# EasyEDA Pro project ESP32 Dev Board.eprj

# Schematic Schematic1
Create Date: 2024-06-08; Page Name: P1; Project Name: ESP32 Dev Board; Schematic Name: Schematic1; Update Date: 2024-06-10; Company: EasyEDA.com; Drawn: EasyEDA; Page Size: A4; Part Number: JLCPCB-002; Reviewed: EasyEDA; Version: V0.1
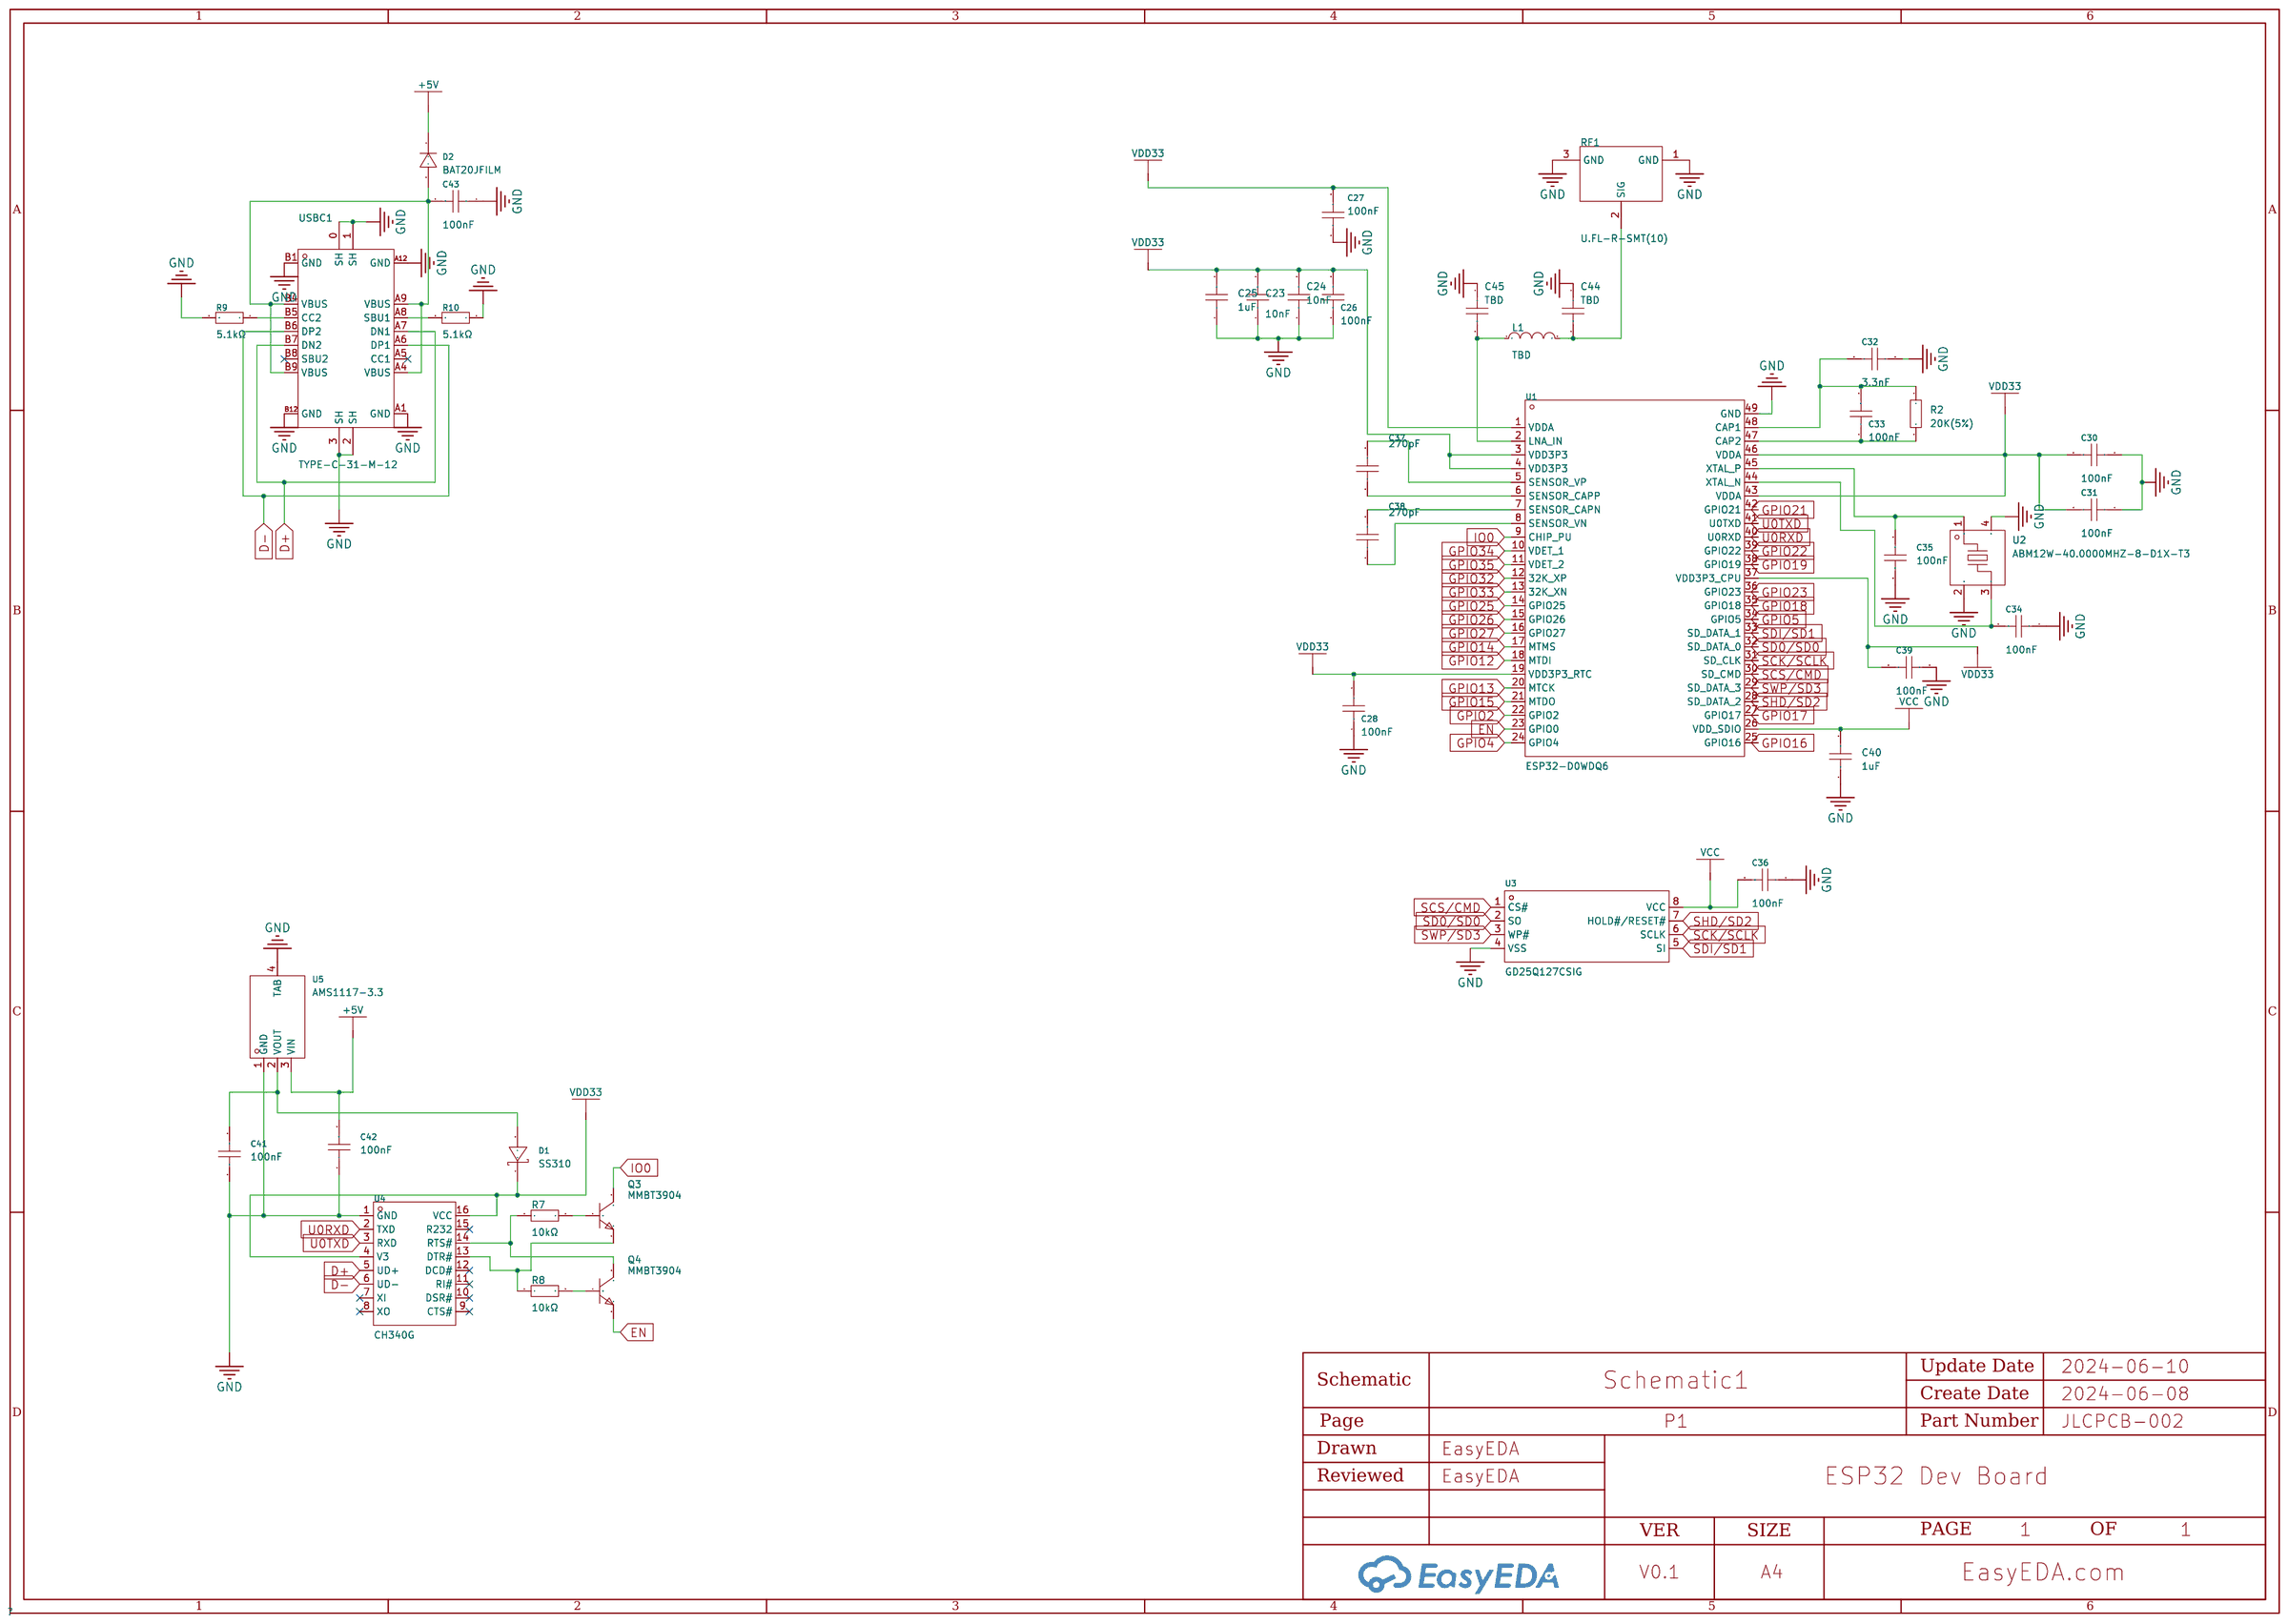
[diagram p0: schematic sheet]

## Parts
C23  10nF  [C0402]
C24  10nF  [C0402]
C25  1uF  [C0402]
C26  100nF  [C0402]
C27  100nF  [C0402]
C28  100nF  [C0402]
C30  100nF  [C0402]
C31  100nF  [C0402]
C32  3.3nF  [C0402]
C33  100nF  [C0402]
C34  100nF  [C0402]
C35  100nF  [C0402]
C36  100nF  [C0402]
C37  270pF  [C0402]
C38  270pF  [C0402]
C39  100nF  [C0402]
C40  1uF  [C0402]
C41  100nF  [C0402]
C42  100nF  [C0402]
C43  100nF  [C0402]
C44  TBD  [C0603]
C45  TBD  [C0603]
D1  SS310  [SMA_L4.4-W2.8-LS5.4-RD]
D2  BAT20JFILM  [SOD-323_L1.8-W1.3-LS2.5-RD]
L1  TBD  [L0603]
Q3  MMBT3904  [SOT-23-3_L2.9-W1.3-P1.90-LS2.4-BR]
Q4  MMBT3904  [SOT-23-3_L2.9-W1.3-P1.90-LS2.4-BR]
R2  20K(5%)  [R0603]
R7  10kΩ  [R0402]
R8  10kΩ  [R0402]
R9  5.1kΩ  [R0402]
R10  5.1kΩ  [R0402]
RF1  U.FL-R-SMT(10)  [ANT-SMD_UFL-R-SMT01]
U1  ESP32-D0WDQ6  [QFN-48_L6.0-W6.0-P0.40-BL-EP3.8]
U2  ABM12W-40.0000MHZ-8-D1X-T3  [CRYSTAL-SMD_4P-L1.6-W1.2-BL]
U3  GD25Q127CSIG  [SOP-8_L5.3-W5.3-P1.27-LS8.0-BL]
U4  CH340G  [SOIC-16_L9.9-W3.9-P1.27-LS6.0-BL]
U5  AMS1117-3.3  [SOT-223-3_L6.5-W3.4-P2.30-LS7.0-BR]
USBC1  TYPE-C-31-M-12  [USB-C_SMD-TYPE-C-31-M-12]

## Library data of the parts
C23 C24 = 0402B103K160NT: Capacitance:10nF Tolerance:±10% Tolerance:±10% Voltage Rated: Temperature Coefficient:; LCSC Part Name: 10nF ±10% 16V; Supplier Part: C284979; Manufacturer: FH(风华); Supplier Footprint: 0402; JLCPCB Part Class: Extended Part; Datasheet: https://atta.szlcsc.com/upload/public/pdf/source/20200305/C486355_26A10D38EF8C2A5C37091D0039909270.pdf; Supplier: LCSC; Tolerance: ±10%
C25 C40 = C0402X5R105K350NT: Capacitance: Tolerance:±10% Tolerance:±10% Voltage Rated: Temperature Coefficient:; LCSC Part Name: 1uF ±10% 35V; Supplier Part: C968773; Manufacturer: SANYEAR(叁叶源); Supplier Footprint: 0402; JLCPCB Part Class: Extended Part; Supplier: LCSC; Tolerance: ±10%
C26-C28 C30 C31 C33-C36 C39 C41-C43 = CT41G-0402-2X1-16V-0.1μF-K(N): Capacitance: Tolerance:±10% Tolerance:±10% Voltage Rated: Temperature Coefficient:; LCSC Part Name: 100nF ±10% 16V; Supplier Part: C141382; Manufacturer: TORCH(火炬); Supplier Footprint: 0402; JLCPCB Part Class: Extended Part; Datasheet: https://atta.szlcsc.com/upload/public/pdf/source/20171225/C150708_15141883600121203188.pdf; Supplier: LCSC; Tolerance: ±10%
C32 = 04025C332KAT2A: Capacitance: Tolerance:±10% Tolerance:±10% Voltage Rated: Temperature Coefficient:; LCSC Part Name: 3.3nF ±10% 50V; Supplier Part: C167426; Manufacturer: Kyocera AVX; Supplier Footprint: 0402; JLCPCB Part Class: Extended Part; Datasheet: https://atta.szlcsc.com/upload/public/pdf/source/20180224/C180862_15194369279611363953.pdf; Supplier: LCSC; Tolerance: ±10%
C37 C38 = 0402N271J500CT: Capacitance: Tolerance:±5% Tolerance:±5% Voltage Rated: Temperature Coefficient:; LCSC Part Name: 270pF ±5% 50V; Supplier Part: C301975; Manufacturer: Walsin(华新科); Supplier Footprint: 0402; JLCPCB Part Class: Extended Part; Datasheet: https://atta.szlcsc.com/upload/public/pdf/source/20191217/C469650_84AD5C6F618CF4AC0C6D987F2E8FE6F8.pdf; Supplier: LCSC; Tolerance: ±5%
C44 C45 = CAP_0603: Supplier Footprint: 0603
D1 = SS310_C116705: Forward Voltage (Vf@If):850mV@3A Reverse Voltage (Vr):100V Average Rectified Current (Io):3A Reverse Leakage Current (Ir):300uA@100V Peak forward surge current:80A; LCSC Part Name: 电压:100V 电流:3A; Supplier Part: C116705; Manufacturer: 晶导微电子; Supplier Footprint: SMA(DO-214AC); JLCPCB Part Class: Extended Part; Datasheet: https://atta.szlcsc.com/upload/public/pdf/source/20170804/C123938_1501836222047866178.pdf; Supplier: LCSC; Forward Voltage (Vf@If): 850mV@3A; Reverse Voltage (Vr): 100V; Average Rectified Current (Io): 3A; Reverse Leakage Current (Ir): 300uA@100V; Peak forward surge current: 80A
D2 = BAT20JFILM: Forward Voltage (Vf@If):620mV@1A Reverse Voltage (Vr):23V Average Rectified Current (Io):1A Reverse Leakage Current (Ir):12uA@15V; LCSC Part Name: 电压:23V 电流:1A; Supplier Part: C155590; Manufacturer: ST(意法半导体); Supplier Footprint: SOD-323; JLCPCB Part Class: Extended Part; Datasheet: https://atta.szlcsc.com/upload/public/pdf/source/20180105/C155590_15151361543791233625.pdf; Supplier: LCSC; Forward Voltage (Vf@If): 620mV@1A; Reverse Voltage (Vr): 23V; Average Rectified Current (Io): 1A; Reverse Leakage Current (Ir): 12uA@15V
L1 = L_0603
Q3 Q4 = MMBT3904_C163254: Transistor Type: Collector Current (Ic): Collector-Emitter Breakdown Voltage (Vceo): Power Dissipation (Pd): DC Current Gain (hFE@Ic,Vce):100@10mA,1V DC Current Gain (hFE@Ic,Vce):100@10mA,1V Transition Frequency (fT):300MHz Collector Cut-Off Current (Icbo; LCSC Part Name: NPN 电流:200mA 耐压:40V; Supplier Part: C163254; Manufacturer: FMS(美丽微); Supplier Footprint: SOT-23; JLCPCB Part Class: Extended Part; Datasheet: https://atta.szlcsc.com/upload/public/pdf/source/20180131/C163254_15173931062661329070.pdf; Supplier: LCSC; DC Current Gain (hFE@Ic,Vce): 100@10mA,1V; Transition Frequency (fT): 300MHz; Collector Cut-Off Current (Icbo): 50nA; Collector-Emitter Saturation Voltage (VCE(sat)@Ic,Ib): 300mV@50mA,5mA
R2 = Res_0603: Supplier Footprint: 0603
R7 R8 = RMC040210KFN: Resistance: Tolerance:±1% Tolerance:±1% Power(Watts):; LCSC Part Name: 10kΩ ±1% 62.5mW; Supplier Part: C269674; Manufacturer: Tyohm(幸亚电阻); Supplier Footprint: 0402; JLCPCB Part Class: Extended Part; Datasheet: https://atta.szlcsc.com/upload/public/pdf/source/20190115/C325956_D27151D492FFB3C9AB4A6F14FE01F30A.pdf; Supplier: LCSC; Tolerance: ±1%
R9 R10 = RMC04025.1K1%N: Resistance: Tolerance:±1% Tolerance:±1% Power(Watts):; LCSC Part Name: 5.1kΩ ±1% 62.5mW; Supplier Part: C325521; Manufacturer: Tyohm(幸亚电阻); Supplier Footprint: 0402; JLCPCB Part Class: Extended Part; Datasheet: https://atta.szlcsc.com/upload/public/pdf/source/20190115/C325956_D27151D492FFB3C9AB4A6F14FE01F30A.pdf; Supplier: LCSC; Tolerance: ±1%
RF1 = U.FL-R-SMT(10): Connector Type:板端 Interface Type:内针 Number of Ports:1 Interface Diameter:2mm Interface Length/Height:1.25mm Frequency-Max:6GHz RF Series:IPEX Impedance:50Ω Style:- Contact Material:Brass Operating Temperature Range:-40℃~+90℃ Operating Temperature Range:-4; LCSC Part Name: IPEX 内针; Supplier Part: C434808; Manufacturer: HRS(广濑); Supplier Footprint: SMD; JLCPCB Part Class: Extended Part; Datasheet: https://atta.szlcsc.com/upload/public/pdf/source/20191010/C434816_11DAC26C7ED37A2D3E584E7DBDF6972E.pdf; Supplier: LCSC; Connector Type: 板端; Interface Type: 内针; Number of Ports: 1; Interface Diameter: 2mm; Interface Length/Height: 1.25mm; Frequency-Max: 6GHz; RF Series: IPEX; Impedance: 50Ω; Contact Material: Brass; Operating Temperature Range: -40℃~+90℃
U1 = ESP32-D0WDQ6: Frequency Range:2.4GHz Frequency Range:2.4GHz Interface:I2C,I2S,SPI,UART Operating Voltage:2.3V~3.6V Operating Voltage:2.3V~3.6V Applications:蓝牙,WiFi Output Power:20dBm Data Rate:150Mbps Current Of Transmitting:240mA Sensitivity:-98dBm Receive Current:100; Supplier Part: C129733; Manufacturer: ESPRESSIF(乐鑫); Supplier Footprint: QFN-48-EP(6x6); JLCPCB Part Class: Extended Part; Datasheet: https://atta.szlcsc.com/upload/public/pdf/source/20180207/C129733_15179947908541359020.pdf; Supplier: LCSC; Frequency Range: 2.4GHz; Interface: I2C,I2S,SPI,UART; Operating Voltage: 2.3V~3.6V; Applications: 蓝牙,WiFi; Output Power: 20dBm; Data Rate: 150Mbps; Current Of Transmitting: 240mA; Sensitivity: -98dBm; Receive Current: 100mA; Operating Temperature: -40℃~+125℃
U2 = ABM12W-40.0000MHZ-8-D1X-T3: Supplier Part: C9900011192; Supplier Footprint: CRYSTAL-SMD; JLCPCB Part Class: Extended Part; Supplier: LCSC
U3 = GD25Q127CSIG: Supplier Part: C79079; Manufacturer: GigaDevice(兆易创新); Supplier Footprint: SOP-8-208mil; JLCPCB Part Class: Extended Part; Datasheet: https://atta.szlcsc.com/upload/public/pdf/source/20171014/C79079_15079757657721038544.pdf; Supplier: LCSC
U4 = CH340G: Applications Function:Transceiver Protocol: Supply Voltage:3.3V；5V Supply Voltage:3.3V；5V Data Rate:2Mbps; LCSC Part Name: USB转串口芯片 CH340; Supplier Part: C14267; Manufacturer: WCH(南京沁恒); Supplier Footprint: SOP-16; JLCPCB Part Class: Extended Part; Datasheet: https://atta.szlcsc.com/upload/public/pdf/source/20230530/6E401E9554E9F5311886CC8B3F89B62E.pdf; Supplier: LCSC; Applications Function: Transceiver; Supply Voltage: 3.3V；5V; Data Rate: 2Mbps
U5 = AMS1117-3.3_C351784: Output Type: Maximum Input Voltage:18V Output Voltage:3.3V Output Voltage:3.3V MAX Output Current:800mA Power Supply Rejection Ratio (PSRR):- Dropout Voltage:1.4V@(1A) Output Polarity:Positive electrode Number of Outputs:1; LCSC Part Name: 输入18V 输出3.3V 800mA; Supplier Part: C351784; Manufacturer: PUOLOP(迪浦); Supplier Footprint: SOT-223-3; JLCPCB Part Class: Extended Part; Datasheet: https://atta.szlcsc.com/upload/public/pdf/source/20210915/EA806799CEEC3F52E0A4FA8303A508AC.pdf; Supplier: LCSC; Maximum Input Voltage: 18V; Output Voltage: 3.3V; MAX Output Current: 800mA; Dropout Voltage: 1.4V@(1A); Output Polarity: Positive electrode; Number of Outputs: 1
USBC1 = TYPE-C-31-M-12: Connector Type:Type-C Standard:- Gender:Female Number of Ports:1 Number of Contacts:16P Mounting Style:- Current Rating - Power (Max):5A Contact Material:- Contact Plating:- Operating Temperature Range:- Operating Temperature Range:- Soldering Temperature; LCSC Part Name: Type-C 母; Supplier Part: C165948; Manufacturer: 韩国韩荣; Supplier Footprint: SMD; JLCPCB Part Class: Extended Part; Datasheet: https://atta.szlcsc.com/upload/public/pdf/source/20220525/466408E853115E789EDB0DDC29077C05.pdf; Supplier: LCSC; Connector Type: Type-C; Gender: Female; Number of Ports: 1; Number of Contacts: 16P; Current Rating - Power (Max): 5A

## Nets
+5V: C42.2 D2.1(K) U5.3(VIN)
GND: C23.1 C24.1 C25.1 C26.1 C27.1 C28.1 C30.1 C31.1 C32.1 C34.1 C35.2 C36.1 C39.1 C40.1 C41.1 C42.1 C43.1 C44.1 C45.1 R9.2 R10.1 RF1.1(GND) RF1.3(GND) U1.49(GND) U2.2(GND) U2.4(GND) U3.4(VSS) U4.1(GND) U5.1(GND) U5.4(TAB) USBC1.0(SH) USBC1.1(SH) USBC1.2(SH) USBC1.3(SH) USBC1.A1(GND) USBC1.A12(GND) USBC1.B1(GND) USBC1.B12(GND)
VCC: C36.2 C40.2 U1.26(VDD_SDIO) U3.8(VCC)
VDD33: C23.2 C24.2 C25.2 C26.2 C27.2 C28.2 C30.2 C31.2 C39.2 D1.1(K) U1.1(VDDA) U1.3(VDD3P3) U1.4(VDD3P3) U1.19(VDD3P3_RTC) U1.37(VDD3P3_CPU) U1.43(VDDA) U1.46(VDDA) U4.4(V3) U4.16(VCC)
D+: U4.5(UD+) USBC1.A7(DN1) USBC1.B7(DN2)
D-: U4.6(UD-) USBC1.A6(DP1) USBC1.B6(DP2)
EN: Q4.2(E) U1.23(GPIO0)
GPIO2: U1.22(GPIO2)
GPIO4: U1.24(GPIO4)
GPIO5: U1.34(GPIO5)
GPIO12: U1.18(MTDI)
GPIO13: U1.20(MTCK)
GPIO14: U1.17(MTMS)
GPIO15: U1.21(MTDO)
GPIO16: U1.25(GPIO16)
GPIO17: U1.27(GPIO17)
GPIO18: U1.35(GPIO18)
GPIO19: U1.38(GPIO19)
GPIO21: U1.42(GPIO21)
GPIO22: U1.39(GPIO22)
GPIO23: U1.36(GPIO23)
GPIO25: U1.14(GPIO25)
GPIO26: U1.15(GPIO26)
GPIO27: U1.16(GPIO27)
GPIO32: U1.12(32K_XP)
GPIO33: U1.13(32K_XN)
GPIO34: U1.10(VDET_1)
GPIO35: U1.11(VDET_2)
IO0: Q3.3(C) U1.9(CHIP_PU)
SCK/SCLK: U1.31(SD_CLK) U3.6(SCLK)
SCS/CMD: U1.30(SD_CMD) U3.1(CS#)
SD0/SD0: U1.32(SD_DATA_0) U3.2(SO)
SDI/SD1: U1.33(SD_DATA_1) U3.5(SI)
SHD/SD2: U1.28(SD_DATA_2) U3.7(HOLD#/RESET#)
SWP/SD3: U1.29(SD_DATA_3) U3.3(WP#)
U0RXD: U1.40(U0RXD) U4.2(TXD)
U0TXD: U1.41(U0TXD) U4.3(RXD)
$1N1054: C38.2 U1.7(SENSOR_CAPN)
$1N1058: C38.1 U1.8(SENSOR_VN)
$1N1106: C37.1 U1.6(SENSOR_CAPP)
$1N1396: C37.2 U1.5(SENSOR_VP)
$1N2334: C32.2 C33.2 R2.1 U1.48(CAP1)
$1N2342: C33.1 R2.2 U1.47(CAP2)
$1N2769: C35.1 U1.45(XTAL_P) U2.1(IN)
$1N2913: C34.2 U1.44(XTAL_N) U2.3(OUT)
$1N7115: Q3.1(B) R7.2
$1N7161: Q4.3(C) R7.1 U4.14(RTS#)
$1N7213: Q4.1(B) R8.2
$1N7216: Q3.2(E) R8.1 U4.13(DTR#)
$1N7414: R10.2 USBC1.A8(SBU1)
$1N7647: R9.1 USBC1.B5(CC2)
$1N7875: C43.2 D2.2(A) USBC1.A4(VBUS) USBC1.A9(VBUS) USBC1.B4(VBUS) USBC1.B9(VBUS)
$1N11049: C41.2 D1.2(A) U5.2(VOUT)
$1N11248: C45.2 L1.1 U1.2(LNA_IN)
$1N11253: C44.2 L1.2 RF1.2(SIG)

Not connected (* = marked no-connect by the designer): U4 7(XI)* 8(XO)* 9(CTS#)* 10(DSR#)* 11(RI#)* 12(DCD#)* 15(R232)*; USBC1 A5(CC1)* B8(SBU2)*

# Board PCB1
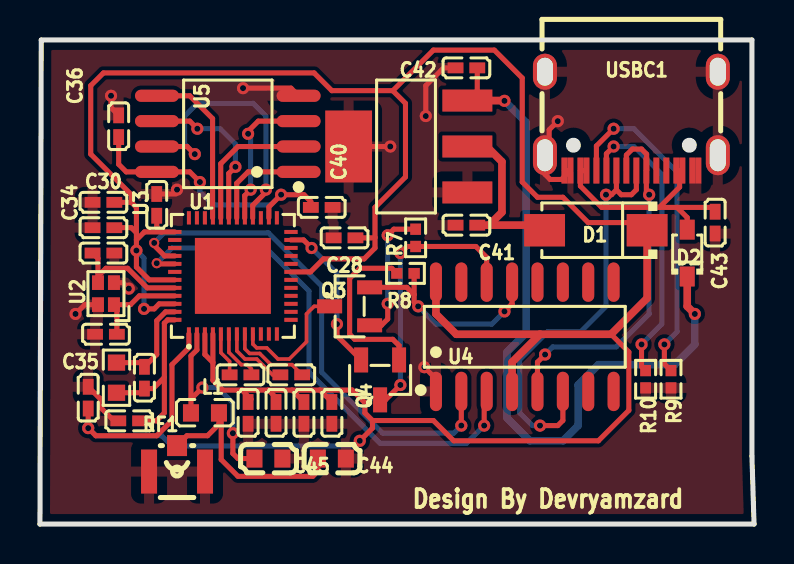
[diagram p1: board, top side]
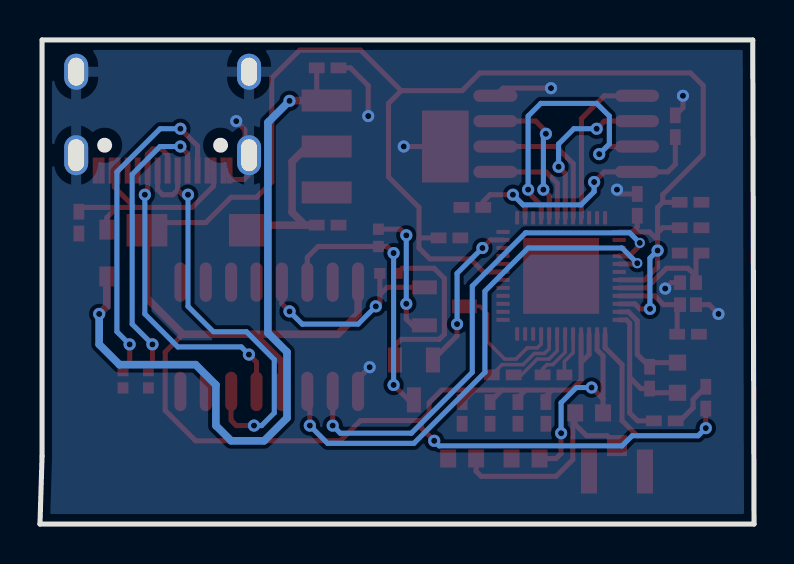
[diagram p2: board, bottom side, seen from below]

Outline 35.73 x 24.23 mm; copper layers: Top Layer, Bottom Layer. Coordinates in mm from the lower left corner of the outline.
Outline path: 0,0 35.73,0 35.62,3.41 35.62,24.23 0.06,24.23 0,0
Stack: Top Layer 0.035mm / Dielectric1 1.51mm FR4 er 4.5 / Bottom Layer 0.035mm

## Design rules (mm)
template: JLCPCB Capability(Two Layers Board)
spacing copperThickness1oz (default): track to track 0.102, other pairs 0.152 to 0.3
spacing copperThickness2oz: track to track 0.203, other pairs 0.152 to 0.3
track width copperThickness1oz (default): min 0.127, default 0.254, max 2.54
track width copperThickness2oz: min 0.203, default 0.254, max 2.54
differential pair differentialPair (default): width min 0.127, default 0.254, max 2.54; gap min 0.152, default 0.152
via viaSize (default): diameter min 0.5, default 0.61, max 10; hole min 0.3, default 0.305, max 6.3

## Placement (name value [footprint] x y rotation side)
C23  10nF  [C0402]  10.41 5.56 90 top
C24  10nF  [C0402]  11.81 5.56 90 top
C25  1uF  [C0402]  14.6 5.56 90 top
C26  100nF  [C0402]  13.21 5.56 90 top
C27  100nF  [C0402]  2.41 6.33 270 top
C28  100nF  [C0402]  15.24 14.33 0 top
C30  100nF  [C0402]  3.18 16.11 0 top
C31  100nF  [C0402]  3.18 14.84 0 top
C32  3.3nF  [C0402]  4.46 5.17 0 top
C33  100nF  [C0402]  5.23 7.33 270 top
C34  100nF  [C0402]  3.18 13.57 180 top
C35  100nF  [C0402]  3.3 9.5 180 top
C36  100nF  [C0402]  3.94 19.92 270 top
C37  270pF  [C0402]  10.03 7.47 180 top
C38  270pF  [C0402]  12.57 7.47 180 top
C39  100nF  [C0402]  5.84 15.98 270 top
C40  1uF  [C0402]  14.1 15.85 180 top
C41  100nF  [C0402]  21.34 14.96 0 top
C42  100nF  [C0402]  21.34 22.84 0 top
C43  100nF  [C0402]  33.78 15.09 90 top
C44  TBD  [C0603]  14.6 3.28 180 top
C45  TBD  [C0603]  11.43 3.28 180 top
D1  SS310  [SMA_L4.4-W2.8-LS5.4-RD]  27.81 14.71 180 top
D2  BAT20JFILM  [SOD-323_L1.8-W1.3-LS2.5-RD]  32.38 13.57 90 top
L1  TBD  [L0603]  8.25 5.56 0 top
Q3  MMBT3904  [SOT-23-3_L2.9-W1.3-P1.90-LS2.4-BR]  15.49 10.9 0 top
Q4  MMBT3904  [SOT-23-3_L2.9-W1.3-P1.90-LS2.4-BR]  17.02 7.22 90 top
R2  20K(5%)  [R0603]  3.83 7.33 90 top
R7  10kΩ  [R0402]  18.8 14.33 90 top
R8  10kΩ  [R0402]  18.29 12.55 180 top
R9  5.1kΩ  [R0402]  31.57 7.25 270 top
R10  5.1kΩ  [R0402]  30.3 7.25 90 top
RF1  U.FL-R-SMT(10)  [ANT-SMD_UFL-R-SMT01]  6.86 3.28 0 top
U1  ESP32-D0WDQ6  [QFN-48_L6.0-W6.0-P0.40-BL-EP3.8]  9.65 12.42 0 top
U2  ABM12W-40.0000MHZ-8-D1X-T3  [CRYSTAL-SMD_4P-L1.6-W1.2-BL]  3.3 11.53 90 top
U3  GD25Q127CSIG  [SOP-8_L5.3-W5.3-P1.27-LS8.0-BL]  9.4 19.53 90 top
U4  CH340G  [SOIC-16_L9.9-W3.9-P1.27-LS6.0-BL]  24.26 9.37 0 top
U5  AMS1117-3.3  [SOT-223-3_L6.5-W3.4-P2.30-LS7.0-BR]  18.41 18.9 0 top
USBC1  TYPE-C-31-M-12  [USB-C_SMD-TYPE-C-31-M-12]  29.59 20.17 180 top

## Footprints (pads in the part's own frame, mm; a bottom-side part is the same pattern mirrored in y, then rotated)
ANT-SMD_UFL-R-SMT01
  rect 0.8x2.2 smd: 1(-1.4,-0.65) 3(1.4,-0.65)
  rect 1x1.05 smd: 2(0,0.65)
C0402
  rect 0.79x0.54 smd: 1(-0.545,0) 2(0.545,0)
C0603
  rect 0.8x0.9 smd: 1(-0.7,0) 2(0.7,0)
CRYSTAL-SMD_4P-L1.6-W1.2-BL
  rect 0.73x0.6 smd: 1(-0.55,-0.4) 2(0.55,-0.4) 3(0.55,0.4) 4(-0.55,0.4)
L0603
  rect 0.8x0.864 smd: 1(-0.7,0) 2(0.7,0)
QFN-48_L6.0-W6.0-P0.40-BL-EP3.8
  rect 0.2x0.665 smd: 1(-2.2,-2.908) 2(-1.8,-2.908) 3(-1.4,-2.908) 4(-1,-2.908) 5(-0.6,-2.908) 6(-0.2,-2.908) 7(0.2,-2.908) 8(0.6,-2.908) 9(1,-2.908) 10(1.4,-2.908) 11(1.8,-2.908) 12(2.2,-2.908) 25(2.2,2.908) 26(1.8,2.908) 27(1.4,2.908) 28(1,2.908) 29(0.6,2.908) 30(0.2,2.908) 31(-0.2,2.908) 32(-0.6,2.908) 33(-1,2.908) 34(-1.4,2.908) 35(-1.8,2.908) 36(-2.2,2.908)
  rect 0.665x0.2 smd: 13(2.908,-2.2) 14(2.908,-1.8) 15(2.908,-1.4) 16(2.908,-1) 17(2.908,-0.6) 18(2.908,-0.2) 19(2.908,0.2) 20(2.908,0.6) 21(2.908,1) 22(2.908,1.4) 23(2.908,1.8) 24(2.908,2.2) 37(-2.908,2.2) 38(-2.908,1.8) 39(-2.908,1.4) 40(-2.908,1) 41(-2.908,0.6) 42(-2.908,0.2) 43(-2.908,-0.2) 44(-2.908,-0.6) 45(-2.908,-1) 46(-2.908,-1.4) 47(-2.908,-1.8) 48(-2.908,-2.2)
  rect 3.8x3.8 smd: 49(0,0)
R0402
  rect 0.566x0.54 smd: 1(-0.433,0) 2(0.433,0)
R0603
  rect 0.806x0.864 smd: 1(-0.753,0) 2(0.753,0)
SMA_L4.4-W2.8-LS5.4-RD
  rect 2.046x1.62 smd: 1(-2.566,0) 2(2.566,0)
SOD-323_L1.8-W1.3-LS2.5-RD
  rect 1x0.75 smd: 1(-1.173,0) 2(1.173,0)
SOIC-16_L9.9-W3.9-P1.27-LS6.0-BL
  oval 0.602x1.971 smd: 1(-4.445,-2.736) 2(-3.175,-2.736) 3(-1.905,-2.736) 4(-0.635,-2.736) 5(0.635,-2.736) 6(1.905,-2.736) 7(3.175,-2.736) 8(4.445,-2.736) 9(4.445,2.736) 10(3.175,2.736) 11(1.905,2.736) 12(0.635,2.736) 13(-0.635,2.736) 14(-1.905,2.736) 15(-3.175,2.736) 16(-4.445,2.736)
SOP-8_L5.3-W5.3-P1.27-LS8.0-BL
  oval 0.609x2.204 smd: 1(-1.905,-3.542) 2(-0.635,-3.542) 3(0.635,-3.542) 4(1.905,-3.542) 5(1.905,3.542) 6(0.635,3.542) 7(-0.635,3.542) 8(-1.905,3.542)
SOT-23-3_L2.9-W1.3-P1.90-LS2.4-BR
  rect 1.25x0.7 smd: 1(1,-0.95) 2(1,0.95) 3(-1,0)
SOT-223-3_L6.5-W3.4-P2.30-LS7.0-BR
  rect 2.5x1.1 smd: 1(2.97,-2.3) 2(2.97,0) 3(2.97,2.3)
  rect 2.34x3.6 smd: 4(-2.97,0)
USB-C_SMD-TYPE-C-31-M-12
  oval 1.2x2 hole 0.8x1.6: 0(-4.325,1.706) 1(4.325,1.706)
  oval 1.2x1.8 hole 0.8x1.4: 2(4.325,-2.474) 3(-4.325,-2.474)
  rect 0.3x1.3 smd: A1(-3.35,2.474) A4(-2.55,2.474) A5(-1.25,2.474) A6(-0.25,2.474) A7(0.25,2.474) A8(1.25,2.474) A9(2.55,2.474) A12(3.35,2.474) B1(3.05,2.474) B4(2.25,2.474) B5(1.75,2.474) B6(0.75,2.474) B7(-0.75,2.474) B8(-1.75,2.474) B9(-2.25,2.474) B12(-3.05,2.474)

## Nets
As in the schematic.

Pads without a net: U4 7 8 9 10 11 12 15; USBC1 A5 B8

## Via types
v1: diameter 0.61, hole 0.305, Top Layer to Bottom Layer, 43 vias
v2: diameter 0.508, hole 0.305, Top Layer to Bottom Layer, 2 vias

## Routing (per net, layer and track width the routed paths; a pad name or vN(x,y) marks a point on that pad's centre or on a via; arc(x,y) is an arc through that point)
+5V: length 37
  Top Layer w0.254: 21.38,21.2 21.88,21.7 C42.2
  Top Layer w0.381: 21.38,21.2 23.23,21.2 v1(23.24,21.19) ; v1(32.77,10.52) 32.38,10.9 D2.1
  Bottom Layer w0.381: v1(23.24,21.19) 24.32,20.1 24.32,9.57 23.37,8.61 23.37,5.31 24.51,4.17 26.16,4.17 26.92,4.93 26.92,6.96 27.94,7.98 31.75,7.98 32.77,8.99 v1(32.77,10.52)
GND: length 21.4
  Top Layer w0.254: C39.1 6.81,16.52 ; USBC1.A12 USBC1.B1 26.09,17.25 25.53,17.25 25.27,17.51 USBC1.1 25.48,18.67 25.48,19.74 v1(25.91,20.17) ; v1(19.23,7.85) 19.81,7.27 U4.1 ; v1(19.3,20.42) 19.3,21.95 20.19,22.84 20.79,22.84 ; U3.4 12.56,21.82 v1(10.16,21.82) ; v1(3.56,21.44) 3.56,20.84 C36.1 ; U2.4 2.24,10.98 v1(1.78,10.52) ; C32.1 3.7,5.17 3.05,5.82 3.05,6.24 C27.1 ; v1(4.44,11.79) 4.15,12.08 3.7,12.08 ; v1(17.53,18.9) U5.4
  vias: v1(6.86,16.74)
VCC: length 14.2
  Top Layer w0.254: C36.2 3.94,18.01 4.32,17.63 U3.8 7.49,17.63 v1(8,17.12) ; C40.2 13.55,16.14 13.21,16.49 v1(12.06,16.49) 11.45,15.87 U1.26
  Bottom Layer w0.254: v1(12.06,16.49) 11.56,15.98 8.66,15.98 8,16.64 v1(8,17.12)
VDD33: length 152.8
  Top Layer w0.254: 4.57,16.11 4.83,15.85 4.83,14.58 ; 4.57,16.11 4.57,16.49 2.54,18.52 2.54,21.95 3.18,22.58 13.72,22.58 14.6,21.69 17.65,21.69 ; 4.57,16.11 C30.2 ; 17.65,21.69 19.69,23.73 22.73,23.73 24.13,22.33 24.13,17.12 24.89,16.36 26.16,16.36 27.43,15.09 30,15.09 D1.1 ; 17.65,21.69 18.29,21.06 18.29,17.38 16.76,15.85 16.76,14.34 ; 14.01,6.71 15.62,6.71 16.26,6.07 16.26,5.56 16.64,5.18 ; 14.01,6.71 C25.2 ; 14.01,6.71 12.61,6.71 ; 16.64,5.18 19.69,5.18 20.7,4.17 27.94,4.17 29.46,5.69 29.46,8.61 28.57,9.5 ; 16.64,5.18 16.64,4.8 v1(16,4.17) ; 4.83,14.22 v1(4.83,13.69) 4.83,12.87 5.47,12.22 U1.43 ; 4.83,14.22 5.23,14.62 6.1,14.62 ; 4.83,14.22 4.83,14.58 ; C27.2 v1(2.41,4.8) 2.79,4.42 5.84,4.42 6.6,5.18 6.6,7.98 7.45,8.83 U1.1 ; C31.2 4.57,14.84 4.83,14.58 ; C26.2 12.61,6.71 ; 12.61,6.71 11.43,6.71 ; U1.46 5.97,11.02 5.72,10.77 v1(5.21,10.77) ; C39.2 5.84,14.88 6.1,14.62 ; 6.1,14.62 U1.37 ; 8.65,8.09 8.65,7.2 9.14,6.71 10.1,6.71 ; 8.65,8.09 U1.4 ; 8.65,8.09 8.25,8.49 U1.3 ; U1.19 13.53,12.62 14.19,13.27 16.22,13.27 16.76,13.82 16.76,14.34 ; C23.2 10.56,6.25 10.1,6.71 ; 10.1,6.71 11.43,6.71 ; C28.2 16.75,14.33 16.76,14.34 ; 11.43,6.71 11.81,6.33 C24.2
  Top Layer w0.381: 25.02,9.5 28.57,9.5 30.38,11.3 D1.1 ; 25.02,9.5 23.62,8.1 U4.4 ; 25.02,9.5 20.83,9.5 19.81,10.52 U4.16
  Bottom Layer w0.254: v1(2.41,4.8) 2.79,4.42 6.1,4.42 6.6,3.91 15.75,3.91 v1(16,4.17) ; v1(5.21,10.77) 5.21,13.31 v1(4.83,13.69)
D+: length 18.1
  Top Layer w0.254: U4.5 24.89,8.1 v1(25.27,8.48) ; USBC1.A7 29.34,18.47 29.64,18.77 30.1,18.77 30.35,18.52 30.35,17.71 USBC1.B7 30.34,16.62 v1(30.48,16.49)
  Bottom Layer w0.254: v1(30.48,16.49) 30.48,10.52 28.83,8.87 25.65,8.87 v1(25.27,8.48)
D-: length 21.4
  Top Layer w0.254: 28.84,16.73 28.6,16.49 v1(28.32,16.49) ; 28.84,16.73 USBC1.B6 ; 28.84,16.73 29.08,16.49 29.59,16.49 29.84,16.74 USBC1.A6 ; U4.6 26.16,5.18 25.91,4.93 v1(25.02,4.93)
  Bottom Layer w0.254: v1(25.02,4.93) 24.64,4.93 24,5.56 24,8.23 25.4,9.63 27.05,9.63 28.32,10.9 v1(28.32,16.49)
EN: length 7.8
  Top Layer w0.254: v1(14.86,10.01) 14.86,9.42 Q4.2 ; U1.23 13.19,14.22 v1(13.59,13.82)
  Bottom Layer w0.254: v1(14.86,10.01) 14.86,12.55 v1(13.59,13.82)
IO0: length 6.6
  Top Layer w0.178: U1.9 10.65,9.01 10.84,8.82 11.35,8.82 11.91,8.26 12.47,8.26 13.34,9.12 13.34,10.52 13.72,10.9 Q3.3
SCK/SCLK: length 8.2
  Top Layer w0.254: U3.6 7.49,20.17 v1(7.87,19.79) ; v1(9.78,17.88) 9.44,17.55 9.44,15.32
  Bottom Layer w0.254: v1(7.87,19.79) 9.02,19.79 9.78,19.03 v1(9.78,17.88)
SCS/CMD: length 5.1
  Top Layer w0.254: U3.1 10.41,17.63 9.84,17.06 9.84,15.32
SD0/SD0: length 7
  Top Layer w0.254: U3.2 9.91,18.9 9.04,18.04 9.04,15.32
SDI/SD1: length 8.2
  Top Layer w0.254: 8.64,15.33 8.64,20.3 7.49,21.44 U3.5
SHD/SD2: length 14.1
  Top Layer w0.254: v1(11.3,16.74) 11.3,16.61 10.64,15.95 10.64,15.32 ; U3.7 7.37,18.9 v1(7.75,18.52)
  Bottom Layer w0.254: v1(7.75,18.52) 7.24,19.03 7.24,20.42 7.87,21.06 10.67,21.06 11.3,20.42 v1(11.3,16.74)
SWP/SD3: length 7.3
  Top Layer w0.254: v1(10.54,16.74) 10.24,16.44 10.24,15.32 ; v1(10.41,19.53) 10.41,19.66 10.92,20.17 U3.3
  Bottom Layer w0.254: v1(10.41,19.53) 10.54,19.41 v1(10.54,16.74)
U0RXD: length 25.5
  Top Layer w0.254: U1.40 6.24,13.42 5.72,13.95 v2(5.72,14.07) ; v1(21.08,4.93) U4.2
  Bottom Layer w0.254: v1(21.08,4.93) 20.7,4.55 17.15,4.55 14.1,7.6 14.1,11.91 11.43,14.58 6.22,14.58 v2(5.72,14.07)
U0TXD: length 26.2
  Top Layer w0.254: U1.41 5.88,13.02 v2(5.84,13.06) ; U4.3 22.22,6.51 v1(22.22,4.93)
  Bottom Layer w0.254: v1(22.22,4.93) 21.34,4.04 17.02,4.04 13.46,7.6 13.46,11.66 11.3,13.82 6.6,13.82 v2(5.84,13.06)
$1N1054: length 3.5
  Top Layer w0.178: C38.2 11.64,7.47 10.85,8.26 10.26,8.26 9.85,8.67 U1.7
$1N1058: length 4.1
  Top Layer w0.178: U1.8 10.25,8.77 10.49,8.54 11,8.54 11.55,7.98 12.61,7.98 C38.1
$1N1106: length 2.7
  Top Layer w0.178: C37.1 10.58,7.76 10.36,7.98 10.07,7.98 9.45,8.59 U1.6
$1N1396: length 2.2
  Top Layer w0.178: U1.5 9.05,8.58 9.49,8.14 C37.2
$1N2334: length 9.2
  Top Layer w0.254: U1.48 6.39,10.22 6.22,10.06 6.22,7.34 ; 6.22,7.34 5.66,6.78 C33.2 5.02,6.57 R2.1 ; 6.22,7.34 6.22,5.56 5.83,5.17 5.01,5.17
$1N2342: length 5.1
  Top Layer w0.254: R2.2 5.02,8.08 C33.1 5.84,8.49 5.84,10.18 6.28,10.62 U1.47
$1N2769: length 4.8
  Top Layer w0.254: C35.1 3.85,10.84 U2.1 4.53,10.98 4.97,11.42 U1.45
$1N2913: length 6
  Top Layer w0.254: 2.9,12.08 2.9,12.4 ; 2.9,12.4 3.3,12.8 4.39,12.8 5.37,11.82 U1.44 ; 2.9,12.4 2.9,13.29 C34.2
$1N7115: length 6.8
  Top Layer w0.254: v1(17.4,11.03) 17.4,10.26 17.08,9.95 Q3.1 ; v1(17.4,14.45) 17.71,14.76 R7.2
  Bottom Layer w0.254: v1(17.4,11.03) v1(17.4,14.45)
$1N7161: length 13.8
  Top Layer w0.254: U4.14 22.35,13.35 21.81,13.89 R7.1 18.36,13.89 v1(18.03,13.57) ; v1(18.03,6.96) 17.29,6.22 Q4.3
  Bottom Layer w0.254: v1(18.03,13.57) v1(18.03,6.96)
$1N7213: length 8.9
  Top Layer w0.254: Q4.1 17.97,8.93 17.65,9.25 15.75,9.25 15.49,9.5 15.49,12.3 16,12.8 17.6,12.8 17.85,12.55
$1N7216: length 10.7
  Top Layer w0.254: v1(23.24,10.64) 23.62,11.03 U4.13 ; 18.72,11.48 18.72,11.1 v1(18.92,10.9) ; 18.72,11.48 R8.1 ; 18.72,11.48 18.35,11.85 Q3.2
  Bottom Layer w0.254: v1(18.92,10.9) 19.81,10.01 22.61,10.01 v1(23.24,10.64)
$1N7414: length 14.7
  Top Layer w0.254: R10.2 30.1,7.89 v1(30.1,8.99) ; USBC1.A8 28.34,18.54 v1(28.7,18.9)
  Bottom Layer w0.254: v1(28.7,18.9) 29.72,18.9 31.12,17.5 31.12,10.01 v1(30.1,8.99)
$1N7647: length 16.9
  Top Layer w0.254: R9.1 31.24,8.01 v1(31.24,8.99) ; v1(28.7,19.79) 27.84,18.93 USBC1.B5
  Bottom Layer w0.254: v1(28.7,19.79) 29.72,19.79 31.88,17.63 31.88,9.63 v1(31.24,8.99)
$1N7875: length 12.3
  Top Layer w0.254: USBC1.B4 USBC1.A9 27.04,16.92 28.11,15.85 30.99,15.85 ; 30.99,15.85 32,16.87 32,17.56 USBC1.A4 USBC1.B9 ; 30.99,15.85 31.88,15.85 ; 31.88,15.85 32.38,15.34 D2.2 ; 31.88,15.85 33.56,15.85 C43.2
$1N11049: length 9
  Top Layer w0.381: C41.2 22.47,14.96 ; 22.47,14.96 23.11,15.61 23.11,18.14 22.35,18.9 U5.2 ; 22.47,14.96 24.99,14.96 D1.2
$1N11248: length 10.4
  Top Layer w0.254: C45.2 9.91,3.28 9.65,3.53 v1(9.65,4.55) ; v1(8.13,6.83) 7.56,6.26 ; 7.56,6.26 L1.1 ; 7.56,6.26 7.56,8.42 7.85,8.72 U1.2
  Bottom Layer w0.254: v1(8.13,6.83) 8.89,6.83 9.65,6.07 v1(9.65,4.55)
$1N11253: length 11.4
  Top Layer w0.254: RF1.2 7.35,4.42 8.38,4.42 8.96,4.99 L1.2 9.07,5.45 9.07,3.23 9.91,2.39 13.65,2.39 13.91,2.64 C44.2

## Copper pours and planes (outline as drawn; the poured copper is in the pictures)
GND on Top Layer: -0.19,24.36 35.47,24.36 35.47,0.13 -0.19,0.13
GND on Bottom Layer: 0.06,24.23 35.73,24.23 35.73,0 0.06,0

## Text on the board
Top Silkscreen Layer: Design By Devryamzard
